# Altium schematic sheet ECU_Sheet3.SchDoc
size A3
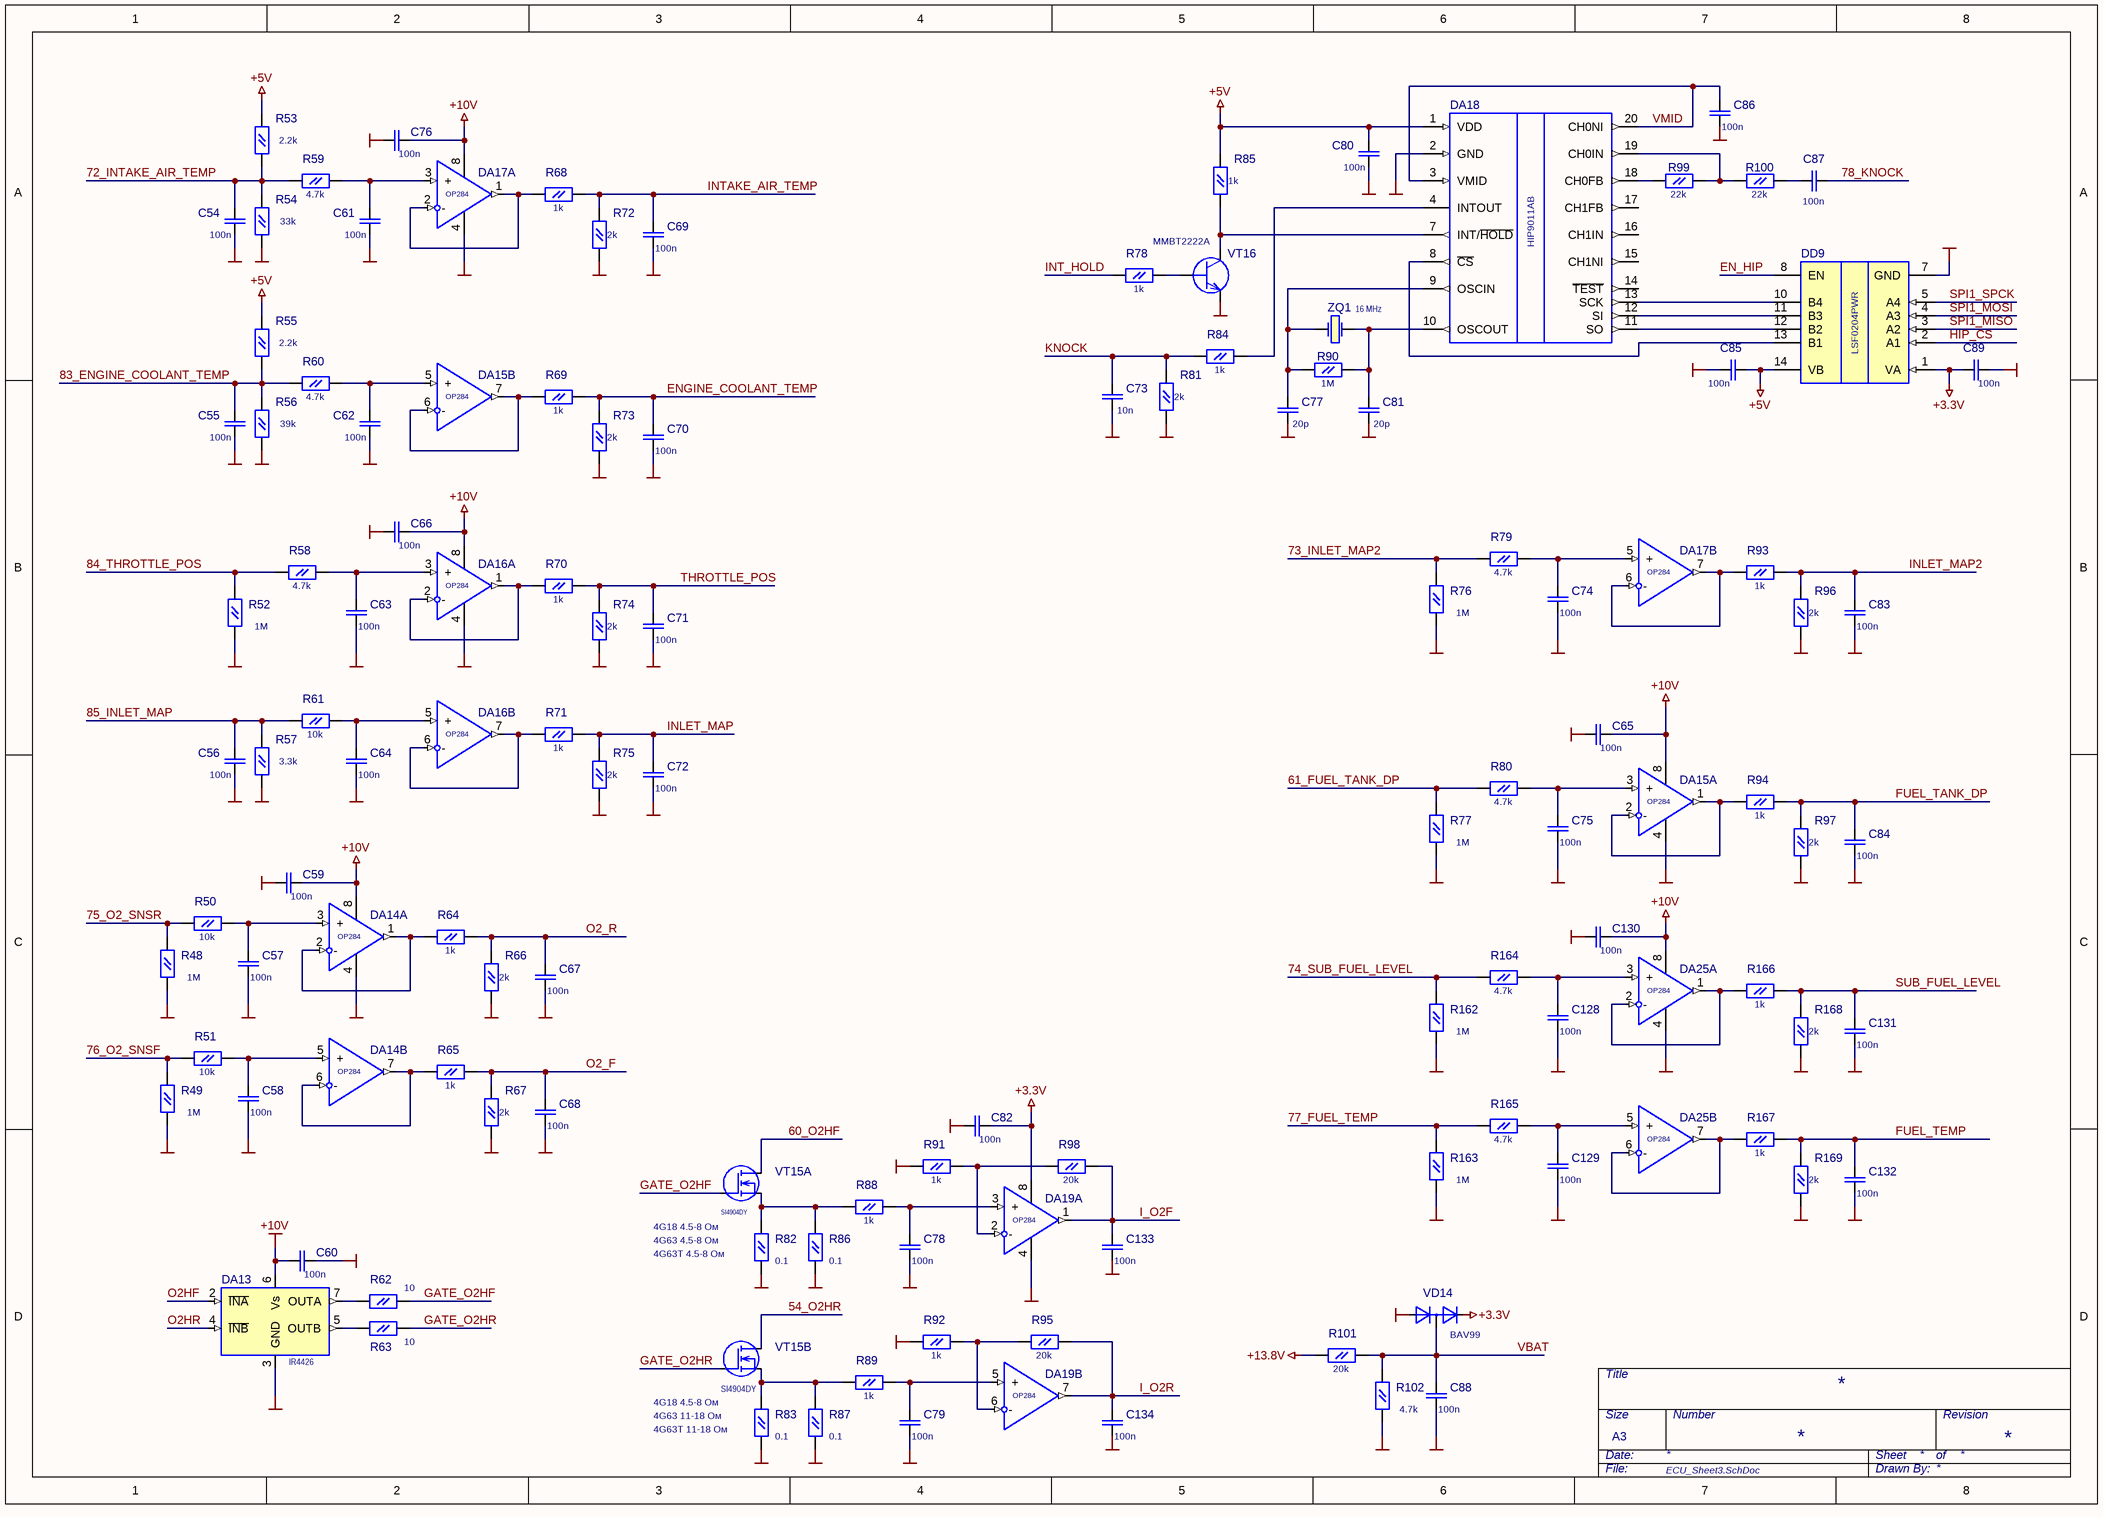
[diagram p0: ECU_Sheet3.SchDoc]

## Parts
C54  value 100n  [C0805L]  (hidden comment: CSMD)
C55  value 100n  [C0805L]  (hidden comment: CSMD)
C56  value 100n  [C0805L]  (hidden comment: CSMD)
C57  value 100n  [C0805L]  (hidden comment: CSMD)
C58  value 100n  [C0805L]  (hidden comment: CSMD)
C59  value 100n  [C0805L]  (hidden comment: CSMD)
C60  value 100n  [C0805L]  (hidden comment: CSMD)
C61  value 100n  [C0805L]  (hidden comment: CSMD)
C62  value 100n  [C0805L]  (hidden comment: CSMD)
C63  value 100n  [C0805L]  (hidden comment: CSMD)
C64  value 100n  [C0805L]  (hidden comment: CSMD)
C65  value 100n  [C0805L]  (hidden comment: CSMD)
C66  value 100n  [C0805L]  (hidden comment: CSMD)
C67  value 100n  [C0603L]  (hidden comment: CSMD)
C68  value 100n  [C0603L]  (hidden comment: CSMD)
C69  value 100n  [C0603L]  (hidden comment: CSMD)
C70  value 100n  [C0603L]  (hidden comment: CSMD)
C71  value 100n  [C0603L]  (hidden comment: CSMD)
C72  value 100n  [C0603L]  (hidden comment: CSMD)
C73  value 10n  [C0603L]  (hidden comment: CSMD)
C74  value 100n  [C0805L]  (hidden comment: CSMD)
C75  value 100n  [C0805L]  (hidden comment: CSMD)
C76  value 100n  [C0805L]  (hidden comment: CSMD)
C77  value 20p  [C0805L]  (hidden comment: CSMD)
C78  value 100n  [C0805L]  (hidden comment: CSMD)
C79  value 100n  [C0805L]  (hidden comment: CSMD)
C80  value 100n  [C0805L]  (hidden comment: CSMD)
C81  value 20p  [C0805L]  (hidden comment: CSMD)
C82  value 100n  [C0805L]  (hidden comment: CSMD)
C83  value 100n  [C0603L]  (hidden comment: CSMD)
C84  value 100n  [C0603L]  (hidden comment: CSMD)
C85  value 100n  [C0805L]  (hidden comment: CSMD)
C86  value 100n  [C0805L]  (hidden comment: CSMD)
C87  value 100n  [C0805L]  (hidden comment: CSMD)
C88  value 100n  [C0603L]  (hidden comment: CSMD)
C89  value 100n  [C0805L]  (hidden comment: CSMD)
C128  value 100n  [C0805L]  (hidden comment: CSMD)
C129  value 100n  [C0805L]  (hidden comment: CSMD)
C130  value 100n  [C0805L]  (hidden comment: CSMD)
C131  value 100n  [C0603L]  (hidden comment: CSMD)
C132  value 100n  [C0603L]  (hidden comment: CSMD)
C133  value 100n  [C0603L]  (hidden comment: CSMD)
C134  value 100n  [C0603L]  (hidden comment: CSMD)
DA13  IR4426  [SOIC8 JEDEC]
DA14  OP284  [SOIC8 JEDEC]  (parts A,B of 2)
DA15  OP284  [SOIC8 JEDEC]  (parts A,B of 2)
DA16  OP284  [SOIC8 JEDEC]  (parts A,B of 2)
DA17  OP284  [SOIC8 JEDEC]  (parts A,B of 2)
DA18  HIP9011AB  [SOIC-20 (JEDEC MS-013-AC)]
DA19  OP284  [SOIC8 JEDEC]  (parts A,B of 2)
DA25  OP284  [SOIC8 JEDEC]  (parts A,B of 2)
DD9  LSF0204PWR  [TSSOP14 (JEDEC MO-153)]
R48  value 1M  [R0805L]  (hidden comment: RSMD)
R49  value 1M  [R0805L]  (hidden comment: RSMD)
R50  value 10k  [R0805L]  (hidden comment: RSMD)
R51  value 10k  [R0805L]  (hidden comment: RSMD)
R52  value 1M  [R0805L]  (hidden comment: RSMD)
R53  value 2.2k  [R0805L]  (hidden comment: RSMD)
R54  value 33k  [R0805L]  (hidden comment: RSMD)
R55  value 2.2k  [R0805L]  (hidden comment: RSMD)
R56  value 39k  [R0805L]  (hidden comment: RSMD)
R57  value 3.3k  [R0805L]  (hidden comment: RSMD)
R58  value 4.7k  [R0805L]  (hidden comment: RSMD)
R59  value 4.7k  [R0805L]  (hidden comment: RSMD)
R60  value 4.7k  [R0805L]  (hidden comment: RSMD)
R61  value 10k  [R0805L]  (hidden comment: RSMD)
R62  value 10  [R0603L]  (hidden comment: RSMD)
R63  value 10  [R0603L]  (hidden comment: RSMD)
R64  value 1k  [R0805L]  (hidden comment: RSMD)
R65  value 1k  [R0805L]  (hidden comment: RSMD)
R66  value 2k  [R0805L]  (hidden comment: RSMD)
R67  value 2k  [R0805L]  (hidden comment: RSMD)
R68  value 1k  [R0805L]  (hidden comment: RSMD)
R69  value 1k  [R0805L]  (hidden comment: RSMD)
R70  value 1k  [R0805L]  (hidden comment: RSMD)
R71  value 1k  [R0805L]  (hidden comment: RSMD)
R72  value 2k  [R0805L]  (hidden comment: RSMD)
R73  value 2k  [R0805L]  (hidden comment: RSMD)
R74  value 2k  [R0805L]  (hidden comment: RSMD)
R75  value 2k  [R0805L]  (hidden comment: RSMD)
R76  value 1M  [R0805L]  (hidden comment: RSMD)
R77  value 1M  [R0805L]  (hidden comment: RSMD)
R78  value 1k  [R0805L]  (hidden comment: RSMD)
R79  value 4.7k  [R0805L]  (hidden comment: RSMD)
R80  value 4.7k  [R0805L]  (hidden comment: RSMD)
R81  value 2k  [R0805L]  (hidden comment: RSMD)
R82  value 0.1  [R0805L]  (hidden comment: RSMD)
R83  value 0.1  [R0805L]  (hidden comment: RSMD)
R84  value 1k  [R0805L]  (hidden comment: RSMD)
R85  value 1k  [R0805L]  (hidden comment: RSMD)
R86  value 0.1  [R0805L]  (hidden comment: RSMD)
R87  value 0.1  [R0805L]  (hidden comment: RSMD)
R88  value 1k  [R0805L]  (hidden comment: RSMD)
R89  value 1k  [R0805L]  (hidden comment: RSMD)
R90  value 1M  [R0805L]  (hidden comment: RSMD)
R91  value 1k  [R0805L]  (hidden comment: RSMD)
R92  value 1k  [R0805L]  (hidden comment: RSMD)
R93  value 1k  [R0805L]  (hidden comment: RSMD)
R94  value 1k  [R0805L]  (hidden comment: RSMD)
R95  value 20k  [R0805L]  (hidden comment: RSMD)
R96  value 2k  [R0805L]  (hidden comment: RSMD)
R97  value 2k  [R0805L]  (hidden comment: RSMD)
R98  value 20k  [R0805L]  (hidden comment: RSMD)
R99  value 22k  [R0805L]  (hidden comment: RSMD)
R100  value 22k  [R0805L]  (hidden comment: RSMD)
R101  value 20k  [R0805L]  (hidden comment: RSMD)
R102  value 4.7k  [R0805L]  (hidden comment: RSMD)
R162  value 1M  [R0805L]  (hidden comment: RSMD)
R163  value 1M  [R0805L]  (hidden comment: RSMD)
R164  value 4.7k  [R0805L]  (hidden comment: RSMD)
R165  value 4.7k  [R0805L]  (hidden comment: RSMD)
R166  value 1k  [R0805L]  (hidden comment: RSMD)
R167  value 1k  [R0805L]  (hidden comment: RSMD)
R168  value 2k  [R0805L]  (hidden comment: RSMD)
R169  value 2k  [R0805L]  (hidden comment: RSMD)
VD14  BAV99  [SOT-23]
VT15  SI4904DY  [SOIC8 DBL FET]  (parts A,B of 2)
VT16  MMBT2222A  [SOT-23_MMBT2222A(Primary)]
ZQ1  16 MHz  [HC-49/S]

## Nets
+3.3V: C82.1 C89.2 DA19.8(V+) DD9.1(VA) VD14.2(K)
+5V: C80.2 C85.2 DA18.1(VDD) DD9.14(VB) R53.2(Pin2) R55.2(Pin2) R85.2(Pin2)
+10V: C59.1 C60.2 C65.1 C66.1 C76.1 C130.1 DA13.6(Vs) DA14.8(V+) DA15.8(V+) DA16.8(V+) DA17.8(V+) DA25.8(V+)
+13.8V: R101.1(Pin1)
GND: C54.2 C55.2 C56.2 C57.2 C58.2 C59.2 C60.1 C61.2 C62.2 C63.2 C64.2 C65.2 C66.2 C67.2 C68.2 C69.2 C70.2 C71.2 C72.2 C73.2 C74.2 C75.2 C76.2 C77.2 C78.2 C79.2 C80.1 C81.2 C82.2 C83.2 C84.2 C85.1 C86.2 C88.2 C89.1 C128.2 C129.2 C130.2 C131.2 C132.2 C133.2 C134.2 DA13.3(GND) DA14.4(V-) DA15.4(V-) DA16.4(V-) DA17.4(V-) DA18.2(GND) DA19.4(V-) DA25.4(V-) DD9.7(GND) R48.1(Pin1) R49.1(Pin1) R52.1(Pin1) R54.1(Pin1) R56.1(Pin1) R57.1(Pin1) R66.1(Pin1) R67.1(Pin1) R72.1(Pin1) R73.1(Pin1) R74.1(Pin1) R75.1(Pin1) R76.1(Pin1) R77.1(Pin1) R81.1(Pin1) R82.2(Pin2) R83.2(Pin2) R86.2(Pin2) R87.2(Pin2) R91.1(Pin1) R92.1(Pin1) R96.1(Pin1) R97.1(Pin1) R102.1(Pin1) R162.1(Pin1) R163.1(Pin1) R168.1(Pin1) R169.1(Pin1) VD14.1(A) VT16.3(E)
54_O2HR: VT15.5
60_O2HF: VT15.6
61_FUEL_TANK_DP: R77.2(Pin2) R80.1(Pin1)
72_INTAKE_AIR_TEMP: C54.1 R53.1(Pin1) R54.2(Pin2) R59.1(Pin1)
73_INLET_MAP2: R76.2(Pin2) R79.1(Pin1)
74_SUB_FUEL_LEVEL: R162.2(Pin2) R164.1(Pin1)
75_O2_SNSR: R48.2(Pin2) R50.1(Pin1)
76_O2_SNSF: R49.2(Pin2) R51.1(Pin1)
77_FUEL_TEMP: R163.2(Pin2) R165.1(Pin1)
78_KNOCK: C87.2
83_ENGINE_COOLANT_TEMP: C55.1 R55.1(Pin1) R56.2(Pin2) R60.1(Pin1)
84_THROTTLE_POS: R52.2(Pin2) R58.1(Pin1)
85_INLET_MAP: C56.1 R57.2(Pin2) R61.1(Pin1)
EN_HIP: DD9.8(EN)
ENGINE_COOLANT_TEMP: C70.1 R69.2(Pin2) R73.2(Pin2)
FUEL_TANK_DP: C84.1 R94.2(Pin2) R97.2(Pin2)
FUEL_TEMP: C132.1 R167.2(Pin2) R169.2(Pin2)
GATE_O2HF: R62.2(Pin2) VT15.2
GATE_O2HR: R63.2(Pin2) VT15.4
HIP_CS: DD9.2(A1)
I_O2F: C133.1 DA19.1(OUT) R98.2(Pin2)
I_O2R: C134.1 DA19.7(OUT) R95.2(Pin2)
INLET_MAP: C72.1 R71.2(Pin2) R75.2(Pin2)
INLET_MAP2: C83.1 R93.2(Pin2) R96.2(Pin2)
INT_HOLD: R78.1(Pin1)
INTAKE_AIR_TEMP: C69.1 R68.2(Pin2) R72.2(Pin2)
KNOCK: C73.1 R81.2(Pin2) R84.1(Pin1)
O2_F: C68.1 R65.2(Pin2) R67.2(Pin2)
O2_R: C67.1 R64.2(Pin2) R66.2(Pin2)
O2HF: DA13.2(~{INA})
O2HR: DA13.4(~{INB})
SPI1_MISO: DD9.3(A2)
SPI1_MOSI: DD9.4(A3)
SPI1_SPCK: DD9.5(A4)
SUB_FUEL_LEVEL: C131.1 R166.2(Pin2) R168.2(Pin2)
THROTTLE_POS: C71.1 R70.2(Pin2) R74.2(Pin2)
VBAT: C88.1 R101.2(Pin2) R102.2(Pin2) VD14.3(C)
VMID: C86.1 DA18.3(VMID) DA18.20(CH0NI)
NetC57_1: C57.1 DA14.3(+) R50.2(Pin2)
NetC58_1: C58.1 DA14.5(+) R51.2(Pin2)
NetC61_1: C61.1 DA17.3(+) R59.2(Pin2)
NetC62_1: C62.1 DA15.5(+) R60.2(Pin2)
NetC63_1: C63.1 DA16.3(+) R58.2(Pin2)
NetC64_1: C64.1 DA16.5(+) R61.2(Pin2)
NetC74_1: C74.1 DA17.5(+) R79.2(Pin2)
NetC75_1: C75.1 DA15.3(+) R80.2(Pin2)
NetC77_1: C77.1 DA18.9(OSCIN) R90.1(Pin1) ZQ1.1
NetC78_1: C78.1 DA19.3(+) R88.2(Pin2)
NetC79_1: C79.1 DA19.5(+) R89.2(Pin2)
NetC81_1: C81.1 DA18.10(OSCOUT) R90.2(Pin2) ZQ1.2
NetC87_1: C87.1 R100.2(Pin2)
NetC128_1: C128.1 DA25.3(+) R164.2(Pin2)
NetC129_1: C129.1 DA25.5(+) R165.2(Pin2)
NetDA13_5: DA13.5(OUTB) R63.1(Pin1)
NetDA13_7: DA13.7(OUTA) R62.1(Pin1)
NetDA14_1: DA14.1(OUT) DA14.2(-) R64.1(Pin1)
NetDA14_6: DA14.6(-) DA14.7(OUT) R65.1(Pin1)
NetDA15_1: DA15.1(OUT) DA15.2(-) R94.1(Pin1)
NetDA15_6: DA15.6(-) DA15.7(OUT) R69.1(Pin1)
NetDA16_1: DA16.1(OUT) DA16.2(-) R70.1(Pin1)
NetDA16_6: DA16.6(-) DA16.7(OUT) R71.1(Pin1)
NetDA17_1: DA17.1(OUT) DA17.2(-) R68.1(Pin1)
NetDA17_6: DA17.6(-) DA17.7(OUT) R93.1(Pin1)
NetDA18_4: DA18.4(INTOUT) R84.2(Pin2)
NetDA18_7: DA18.7(INT/~{HOLD}) R85.1(Pin1) VT16.1(C)
NetDA18_8: DA18.8(~{CS}) DD9.13(B1)
NetDA18_11: DA18.11(SO) DD9.12(B2)
NetDA18_12: DA18.12(SI) DD9.11(B3)
NetDA18_13: DA18.13(SCK) DD9.10(B4)
NetDA18_18: DA18.18(CH0FB) R99.1(Pin1)
NetDA18_19: DA18.19(CH0IN) R99.2(Pin2) R100.1(Pin1)
NetDA19_2: DA19.2(-) R91.2(Pin2) R98.1(Pin1)
NetDA19_6: DA19.6(-) R92.2(Pin2) R95.1(Pin1)
NetDA25_1: DA25.1(OUT) DA25.2(-) R166.1(Pin1)
NetDA25_6: DA25.6(-) DA25.7(OUT) R167.1(Pin1)
NetR78_2: R78.2(Pin2) VT16.2(B)
NetR82_1: R82.1(Pin1) R86.1(Pin1) R88.1(Pin1) VT15.1
NetR83_1: R83.1(Pin1) R87.1(Pin1) R89.1(Pin1) VT15.3

Not connected (* = marked no-connect by the designer): DA18 14(~{TEST}) 15(CH1NI) 16(CH1IN) 17(CH1FB)

## Notes on the sheet
- 4G18 4.5-8 Ом
- 4G63 4.5-8 Ом
- 4G63T 4.5-8 Ом
- 4G63 11-18 Ом
- 4G63T 11-18 Ом
- Title
- Date:
- Size
- A3
- Number
- Sheet
- of
- Revision
- File:
- Drawn By:

## Library data of the parts
C54-C89 C128-C134 = CSMD: C0603; Voltage: *; Part Field 1: *; Part Field 2: *
DA14-DA17 DA19 DA25 = AD822: Value: *
R48-R102 R162-R169 = RSMD: R0805
  R62 R63 R82 R83 R86 R87: Part Field 1: *; Part Field 2: *
VT15 = SQ9945BEY: SI4904DY или IRF7341TRPBF или SI4908DY
ZQ1 = QUARZ: KX-3НЕ-16.0 MHz; Part Field 1: HC-49S
DA13 = IR4426: Part Field 1: *; Part Field 2: *
VD14 = BAV99: Value: *
VT16 = MMBT2222A: Value: *